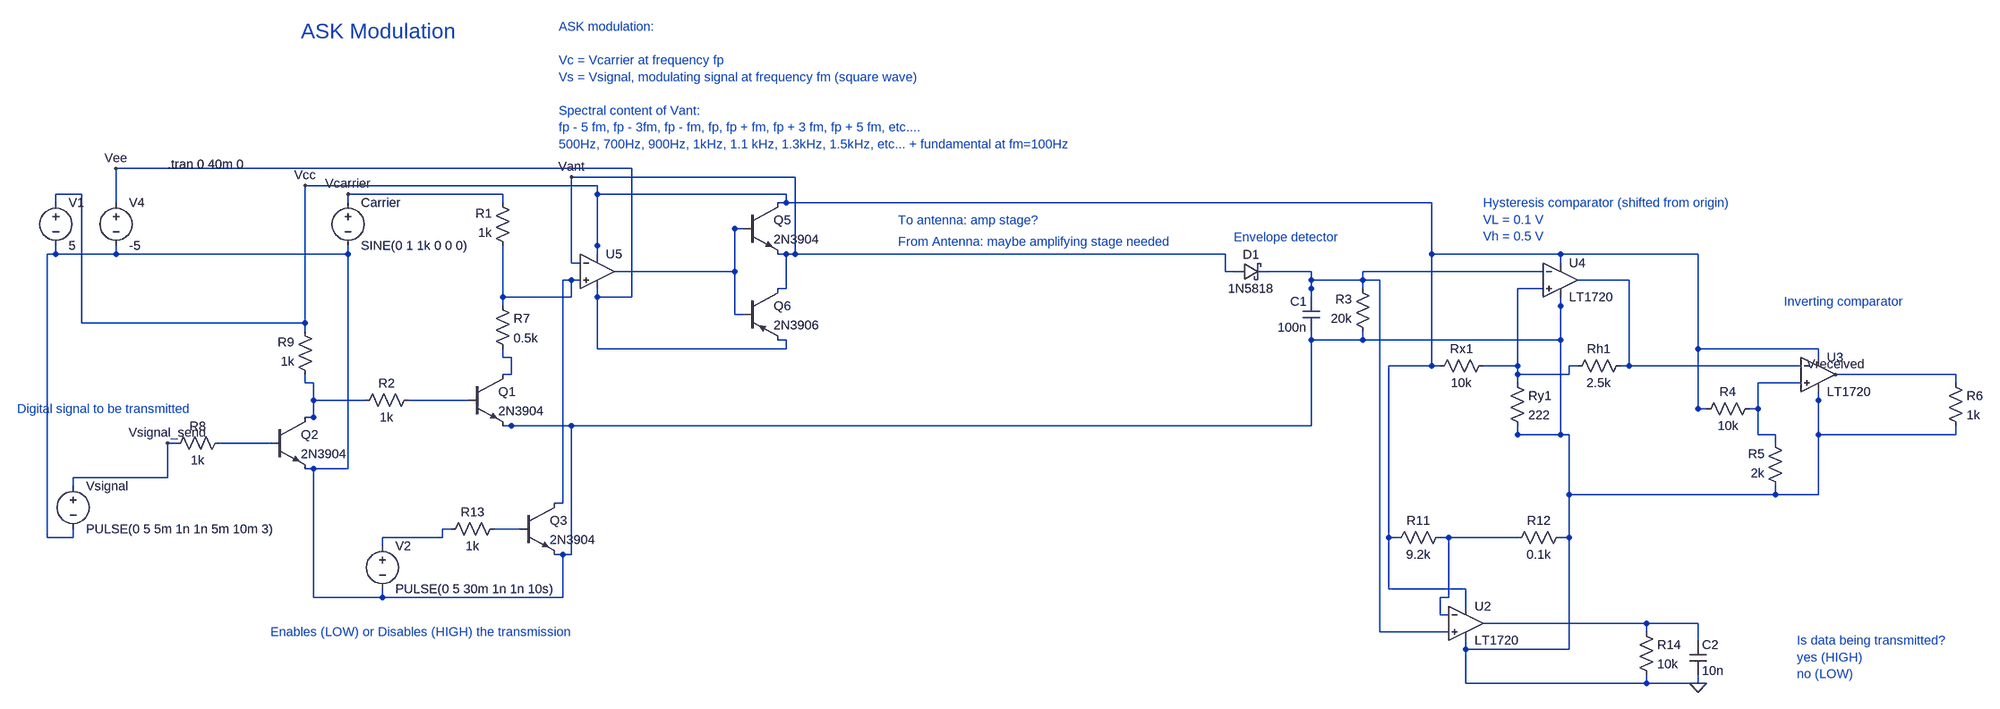
[diagram p0: schematic ASK-modulation3.asc]
ASK-modulation3.asc, the LTspice schematic file:
Version 4.1
SHEET 1 3624 1304
WIRE 1296 304 1296 320
WIRE 2016 944 2016 960
WIRE -512 144 -512 160
WIRE -224 480 -208 480
WIRE -592 560 -576 560
WIRE -128 720 -112 720
WIRE 1760 688 1776 688
WIRE 1920 944 1920 960
WIRE 1392 304 1392 320
WIRE 2160 592 2160 608
WIRE 2496 480 2496 496
WIRE 1680 480 1680 496
WIRE 1584 880 1584 896
WIRE 2240 416 2240 432
WIRE 1760 240 1760 256
WIRE -1056 144 -1056 160
WIRE -448 784 -448 800
WIRE -944 144 -944 160
WIRE -1024 672 -1024 688
WIRE 1296 320 1392 320
WIRE 1392 320 1760 320
WIRE 1760 320 1760 256
WIRE 1760 256 1760 496
WIRE 1760 496 1680 496
WIRE 1680 496 1776 496
WIRE 1776 496 1776 688
WIRE 1776 688 1776 896
WIRE 1776 896 1584 896
WIRE 1584 896 1584 960
WIRE 1584 960 1920 960
WIRE 1920 960 2016 960
WIRE 1776 688 1776 608
WIRE 1776 608 2160 608
WIRE 2160 608 2240 608
WIRE 2240 608 2240 432
WIRE 2240 432 2240 496
WIRE 2240 496 2496 496
WIRE 1296 320 1296 480
WIRE 1296 480 -208 480
WIRE -208 480 -96 480
WIRE -96 480 -96 720
WIRE -96 720 -112 720
WIRE -112 720 -112 800
WIRE -112 800 -448 800
WIRE -448 800 -576 800
WIRE -576 800 -576 560
WIRE -576 560 -512 560
WIRE -512 560 -512 160
WIRE -512 160 -944 160
WIRE -944 160 -1056 160
WIRE -1056 160 -1072 160
WIRE -1072 160 -1072 688
WIRE -1072 688 -1024 688
FLAG 2016 960 0
WIRE 224 112 208 112
WIRE 224 272 208 272
WIRE -16 192 0 192
WIRE 208 112 208 272
WIRE 208 112 208 192
WIRE 208 192 0 192
WIRE 1296 240 1296 224
WIRE 1216 192 1232 192
WIRE 1392 224 1392 208
WIRE 1552 864 1536 864
WIRE 1728 192 1712 192
WIRE 1296 224 1296 192
WIRE 1296 192 1232 192
WIRE 1296 224 1296 208
WIRE 1296 208 1392 208
WIRE 1392 208 1392 192
WIRE 1392 192 1712 192
WIRE 1392 208 1424 208
WIRE 1424 208 1424 864
WIRE 1424 864 1536 864
WIRE -128 624 -112 624
WIRE -224 144 -224 160
WIRE -224 256 -224 240
WIRE -80 208 -96 208
WIRE -112 624 -112 208
WIRE -112 208 -96 208
WIRE -96 208 -96 240
WIRE -96 240 -224 240
WIRE -224 240 -224 160
WIRE 1872 368 1888 368
WIRE 2208 368 2192 368
WIRE 1792 208 1808 208
WIRE 1888 368 1888 208
WIRE 1888 208 1808 208
WIRE 1888 368 2192 368
WIRE 1792 368 1776 368
WIRE 1616 368 1632 368
WIRE 1680 400 1680 384
WIRE 1728 224 1712 224
WIRE 1776 368 1776 384
WIRE 1776 384 1680 384
WIRE 1680 384 1680 368
WIRE 1680 368 1632 368
WIRE 1680 384 1680 224
WIRE 1680 224 1712 224
WIRE -224 384 -208 384
WIRE -224 336 -224 352
WIRE -208 384 -208 352
WIRE -208 352 -224 352
WIRE 2112 448 2128 448
WIRE 2160 512 2160 496
WIRE 2208 400 2192 400
WIRE 2128 448 2128 496
WIRE 2128 496 2160 496
WIRE 2128 448 2128 400
WIRE 2128 400 2192 400
WIRE -592 464 -576 464
WIRE -480 432 -496 432
WIRE -592 384 -592 400
WIRE -576 464 -576 400
WIRE -576 400 -592 400
WIRE -576 464 -576 432
WIRE -576 432 -496 432
WIRE -288 432 -304 432
WIRE -400 432 -384 432
WIRE -304 432 -384 432
WIRE -656 512 -672 512
WIRE -752 512 -736 512
WIRE -672 512 -736 512
WIRE -320 672 -336 672
WIRE -448 704 -448 688
WIRE -336 672 -336 688
WIRE -336 688 -448 688
WIRE -192 672 -208 672
WIRE -240 672 -224 672
WIRE -208 672 -224 672
WIRE 1536 688 1552 688
WIRE 1680 688 1664 688
WIRE 1552 832 1536 832
WIRE 1552 688 1664 688
WIRE 1552 688 1552 800
WIRE 1552 800 1536 800
WIRE 1536 800 1536 832
WIRE 2016 880 2016 864
WIRE 1920 864 1920 848
WIRE 1616 848 1632 848
WIRE 2016 864 2016 848
WIRE 2016 848 1920 848
WIRE 1920 848 1632 848
WIRE 1152 192 1136 192
WIRE 288 160 304 160
WIRE 288 224 304 224
WIRE -80 176 -96 176
WIRE 1136 192 1136 160
WIRE 1136 160 304 160
WIRE 304 160 304 224
WIRE 304 160 320 160
WIRE 320 160 320 16
WIRE 320 16 -96 16
WIRE -96 16 -96 176
FLAG -96 16 Vant
WIRE -512 64 -512 48
WIRE -224 64 -224 48
WIRE -512 48 -224 48
FLAG -512 48 Vcarrier
WIRE 288 64 304 64
WIRE 1456 688 1440 688
WIRE 2032 448 2016 448
WIRE -592 304 -592 288
WIRE 1536 368 1520 368
WIRE 1584 816 1584 800
WIRE 2240 352 2240 336
WIRE 1760 176 1760 160
WIRE -48 160 -48 144
WIRE -1056 64 -1056 48
WIRE 304 64 304 48
WIRE 304 48 -48 48
WIRE -48 48 -48 144
WIRE -48 144 -48 32
WIRE -48 32 -592 32
WIRE -592 32 -592 288
WIRE -592 288 -1008 288
WIRE -1008 288 -1008 48
WIRE -1008 48 -1056 48
WIRE 304 64 1520 64
WIRE 1520 64 1520 368
WIRE 1520 368 1440 368
WIRE 1440 368 1440 688
WIRE 1440 688 1440 784
WIRE 1440 784 1584 784
WIRE 1584 784 1584 800
WIRE 1520 368 1520 160
WIRE 1520 160 1760 160
WIRE 1760 160 2016 160
WIRE 2016 160 2016 448
WIRE 2016 448 2016 336
WIRE 2016 336 2240 336
FLAG -592 32 Vcc
WIRE 288 320 304 320
WIRE -48 224 -48 240
WIRE -944 64 -944 48
WIRE 304 320 304 336
WIRE 304 336 -48 336
WIRE -48 336 -48 240
WIRE -48 240 16 240
WIRE 16 240 16 0
WIRE 16 0 -944 0
WIRE -944 0 -944 48
FLAG -944 0 Vee
WIRE 2496 400 2496 384
WIRE 2272 384 2288 384
WIRE 2496 384 2288 384
FLAG 2272 384 Vreceived
WIRE -832 512 -848 512
WIRE -1024 592 -1024 576
WIRE -848 512 -848 576
WIRE -848 576 -1024 576
FLAG -848 512 Vsignal_send
SYMBOL voltage -1056 48 R0
WINDOW 123 0 0 Left 0
WINDOW 39 0 0 Left 0
SYMATTR InstName V1
SYMATTR Value 5
SYMBOL voltage -512 48 R0
WINDOW 123 0 0 Left 0
WINDOW 39 0 0 Left 0
SYMATTR InstName Carrier
SYMATTR Value SINE(0 1 1k 0 0 0)
SYMBOL res -208 160 R180
WINDOW 0 36 76 Left 2
WINDOW 3 36 40 Left 2
SYMATTR InstName R1
SYMATTR Value 1k
SYMBOL npn -288 384 R0
SYMATTR InstName Q1
SYMATTR Value 2N3904
SYMBOL voltage -1024 576 R0
WINDOW 123 0 0 Left 0
WINDOW 39 0 0 Left 0
SYMATTR InstName Vsignal
SYMATTR Value PULSE(0 5 5m 1n 1n 5m 10m 3)
SYMBOL voltage -944 48 R0
WINDOW 123 0 0 Left 0
WINDOW 39 0 0 Left 0
SYMATTR InstName V4
SYMATTR Value -5
SYMBOL res -384 416 R90
WINDOW 0 0 56 VBottom 2
WINDOW 3 32 56 VTop 2
SYMATTR InstName R2
SYMATTR Value 1k
SYMBOL res 1408 320 R180
WINDOW 0 36 76 Left 2
WINDOW 3 36 40 Left 2
SYMATTR InstName R3
SYMATTR Value 20k
SYMBOL cap 1312 304 R180
WINDOW 0 24 56 Left 2
WINDOW 3 24 8 Left 2
SYMATTR InstName C1
SYMATTR Value 100n
SYMBOL res 1632 352 R90
WINDOW 0 0 56 VBottom 2
WINDOW 3 32 56 VTop 2
SYMATTR InstName Rx1
SYMATTR Value 10k
SYMBOL res 1664 384 R0
SYMATTR InstName Ry1
SYMATTR Value 222
SYMBOL res 1888 352 R90
WINDOW 0 0 56 VBottom 2
WINDOW 3 32 56 VTop 2
SYMATTR InstName Rh1
SYMATTR Value 2.5k
SYMBOL Comparators\\LT1720 1760 144 R0
SYMATTR InstName U4
SYMBOL Comparators\\LT1720 2240 320 R0
SYMATTR InstName U3
SYMBOL res 2128 432 R90
WINDOW 0 0 56 VBottom 2
WINDOW 3 32 56 VTop 2
SYMATTR InstName R4
SYMATTR Value 10k
SYMBOL res 2176 608 R180
WINDOW 0 36 76 Left 2
WINDOW 3 36 40 Left 2
SYMATTR InstName R5
SYMATTR Value 2k
SYMBOL res 2480 384 R0
SYMATTR InstName R6
SYMATTR Value 1k
SYMBOL Opamps\\UniversalOpamp2 -48 192 R0
SYMATTR InstName U5
SYMBOL schottky 1152 208 R270
WINDOW 0 32 32 VTop 2
WINDOW 3 0 32 VBottom 2
SYMATTR InstName D1
SYMATTR Value 1N5818
SYMATTR Description Diode
SYMATTR Type diode
SYMBOL res -240 240 R0
SYMATTR InstName R7
SYMATTR Value 0.5k
SYMBOL npn -656 464 R0
SYMATTR InstName Q2
SYMATTR Value 2N3904
SYMBOL res -736 496 R90
WINDOW 0 0 56 VBottom 2
WINDOW 3 32 56 VTop 2
SYMATTR InstName R8
SYMATTR Value 1k
SYMBOL res -576 400 R180
WINDOW 0 36 76 Left 2
WINDOW 3 36 40 Left 2
SYMATTR InstName R9
SYMATTR Value 1k
SYMBOL npn -192 624 R0
SYMATTR InstName Q3
SYMATTR Value 2N3904
SYMBOL res -224 656 R90
WINDOW 0 0 56 VBottom 2
WINDOW 3 32 56 VTop 2
SYMATTR InstName R13
SYMATTR Value 1k
SYMBOL npn 224 64 R0
SYMATTR InstName Q5
SYMATTR Value 2N3904
SYMBOL pnp 224 224 R0
SYMATTR InstName Q6
SYMATTR Value 2N3906
SYMBOL voltage -448 688 R0
WINDOW 123 0 0 Left 0
WINDOW 39 0 0 Left 0
SYMATTR InstName V2
SYMATTR Value PULSE(0 5 30m 1n 1n 10s)
SYMBOL Comparators\\LT1720 1584 784 R0
SYMATTR InstName U2
SYMBOL res 1552 672 R90
WINDOW 0 0 56 VBottom 2
WINDOW 3 32 56 VTop 2
SYMATTR InstName R11
SYMATTR Value 9.2k
SYMBOL res 1776 672 R90
WINDOW 0 0 56 VBottom 2
WINDOW 3 32 56 VTop 2
SYMATTR InstName R12
SYMATTR Value 0.1k
SYMBOL res 1904 848 R0
SYMATTR InstName R14
SYMATTR Value 10k
SYMBOL cap 2000 880 R0
SYMATTR InstName C2
SYMATTR Value 10n
TEXT -600 -256 Left 4 ;ASK Modulation
TEXT -848 -8 Left 2 !.tran 0 40m 0
TEXT 512 96 Left 2 ;To antenna: amp stage?
TEXT -1128 448 Left 2 ;Digital signal to be transmitted
TEXT 512 136 Left 2 ;From Antenna: maybe amplifying stage needed
TEXT 1152 128 Left 2 ;Envelope detector
TEXT 1616 64 Left 2 ;Hysteresis comparator (shifted from origin)\nVL = 0.1 V\nVh = 0.5 V
TEXT 2176 248 Left 2 ;Inverting comparator
TEXT -120 -264 Left 2 ;ASK modulation:\n \nVc = Vcarrier at frequency fp\nVs = Vsignal, modulating signal at frequency fm (square wave)\n \nSpectral content of Vant:\nfp - 5 fm, fp - 3fm, fp - fm, fp, fp + fm, fp + 3 fm, fp + 5 fm, etc....\n500Hz, 700Hz, 900Hz, 1kHz, 1.1 kHz, 1.3kHz, 1.5kHz, etc... + fundamental at fm=100Hz
TEXT -656 864 Left 2 ;Enables (LOW) or Disables (HIGH) the transmission
TEXT 2200 880 Left 2 ;Is data being transmitted?\nyes (HIGH)\nno (LOW)

The netlist it stands for:
* ASK-modulation3.asc
V1 Vcc 0 5
V§Carrier Vcarrier 0 SINE(0 1 1k 0 0 0)
R1 N003 Vcarrier 1k
Q1 N006 N009 0 0 2N3904
Vsignal Vsignal_send 0 PULSE(0 5 5m 1n 1n 5m 10m 3)
V4 Vee 0 -5
R2 N009 N008 1k
R3 0 N002 20k
C1 0 N002 100n
Rx1 N005 Vcc 10k
Ry1 N005 0 222
Rh1 N004 N005 2.5k
X§U4 N005 N002 Vcc 0 N004 LT1720  ; pins In+ In- V+ V- OUT
X§U3 N007 N004 Vcc 0 Vreceived LT1720  ; pins In+ In- V+ V- OUT
R4 N007 Vcc 10k
R5 0 N007 2k
R6 Vreceived 0 1k
X§U5 N003 Vant Vcc Vee N001 level.2 Avol=1Meg GBW=10Meg Slew=10Meg ilimit=25m rail=0 Vos=0 phimargin=45 en=0 enk=0 in=0 ink=0 Rin=500Meg  ; pins IN+ IN- V+ V- OUT
D1 Vant N002 1N5818
R7 N003 N006 0.5k
Q2 N008 N010 0 0 2N3904
R8 N010 Vsignal_send 1k
R9 N008 Vcc 1k
Q3 N003 N012 0 0 2N3904
R13 N012 N011 1k
Q5 Vcc N001 Vant 0 2N3904
Q6 Vant N001 Vee 0 2N3906
V2 N011 0 PULSE(0 5 30m 1n 1n 10s)
X§U2 N002 N013 Vcc 0 N014 LT1720  ; pins In+ In- V+ V- OUT
R11 N013 Vcc 9.2k
R12 0 N013 0.1k
R14 N014 0 10k
C2 N014 0 10n
.model D D
.lib standard.dio
.model NPN NPN
.model PNP PNP
.lib standard.bjt
* ASK Modulation
.tran 0 40m 0
* To antenna: amp stage?
* Digital signal to be transmitted
* From Antenna: maybe amplifying stage needed
* Envelope detector
* Hysteresis comparator (shifted from origin)
* VL = 0.1 V
* Vh = 0.5 V
* Inverting comparator
* ASK modulation:
* Vc = Vcarrier at frequency fp
* Vs = Vsignal, modulating signal at frequency fm (square wave)
* Spectral content of Vant:
* fp - 5 fm, fp - 3fm, fp - fm, fp, fp + fm, fp + 3 fm, fp + 5 fm, etc....
* 500Hz, 700Hz, 900Hz, 1kHz, 1.1 kHz, 1.3kHz, 1.5kHz, etc... + fundamental at fm=100Hz
* Enables (LOW) or Disables (HIGH) the transmission
* Is data being transmitted?
* yes (HIGH)
* no (LOW)
.lib LT1720.sub
.lib UniversalOpamps2.sub
.backanno
.end